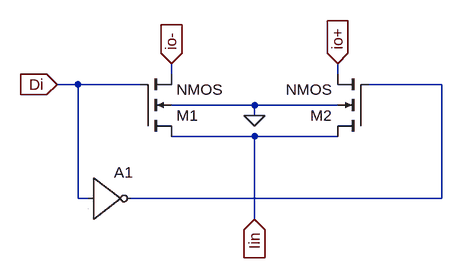
[diagram p0: schematic DifferentialInput.asc]
DifferentialInput.asc, the LTspice schematic file:
Version 4
SHEET 1 880 680
WIRE 192 32 192 16
WIRE 448 32 448 16
WIRE 48 48 16 48
WIRE 144 48 48 48
WIRE 608 48 496 48
WIRE 320 80 192 80
WIRE 448 80 320 80
WIRE 320 96 320 80
WIRE 320 128 192 128
WIRE 448 128 320 128
WIRE 48 224 48 48
WIRE 64 224 48 224
WIRE 608 224 608 48
WIRE 608 224 128 224
WIRE 320 256 320 128
FLAG 320 96 0
FLAG 16 48 Di
IOPIN 16 48 In
FLAG 320 256 Iin
IOPIN 320 256 In
FLAG 192 16 io-
IOPIN 192 16 In
FLAG 448 16 io+
IOPIN 448 16 In
SYMBOL Digital\\inv 64 160 R0
SYMATTR InstName A1
SYMBOL nmos4 144 128 M180
SYMATTR InstName M1
SYMATTR Value2 l=45n w=120n
SYMBOL nmos4 496 128 R180
SYMATTR InstName M2
SYMATTR Value2 l=120n w=45n

The netlist it stands for:
* DifferentialInput.asc
A1 Di 0 0 0 0 N001 0 0 BUF
M1 Iin Di io- 0 NMOS l=45n w=120n
M2 Iin N001 io+ 0 NMOS l=120n w=45n
.model NMOS NMOS
.model PMOS PMOS
.lib standard.mos
.backanno
.end